# EAGLE design Schematic (EAGLE 7.7.0)
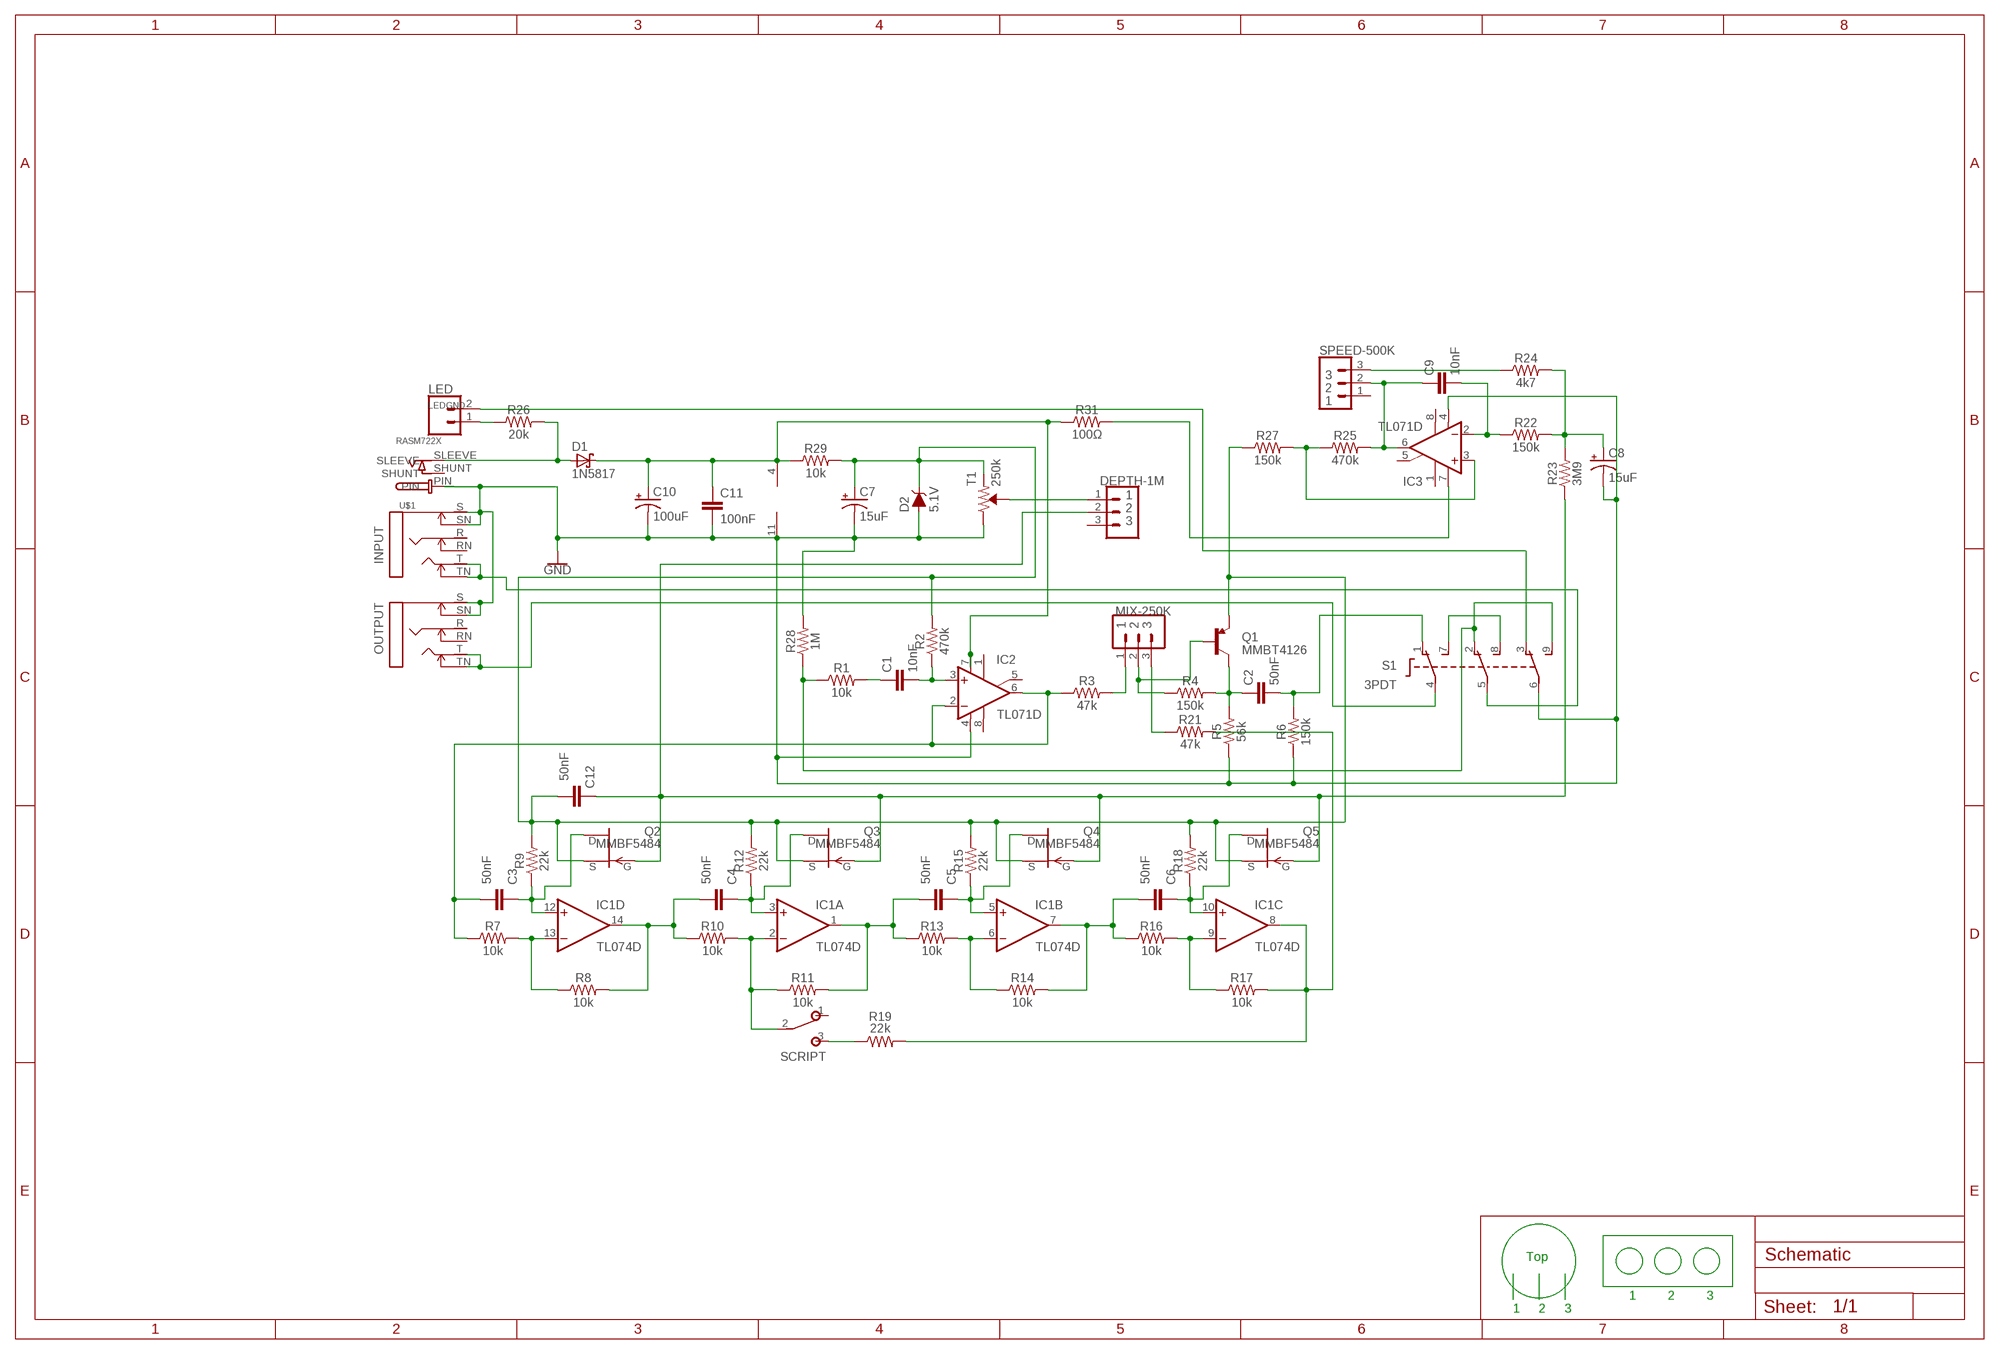
[diagram p0: schematic, sheet 1]

## Parts
C1  10nF  0.1UF-0603-25V-(+80/-20%)  [0603]
C2  50nF  0.1UF-0603-25V-(+80/-20%)  [0603]
C3  50nF  10NF-0603-50V-10%  [0603]
C4  50nF  10NF-0603-50V-10%  [0603]
C5  50nF  10NF-0603-50V-10%  [0603]
C6  50nF  10NF-0603-50V-10%  [0603]
C7  15uF  100UF-POLAR-EIA7343-10V-10%(TANT)  [EIA7343]
C8  15uF  100UF-POLAR-EIA7343-10V-10%(TANT)  [EIA7343]
C9  10nF  0.1UF-0603-25V-(+80/-20%)  [0603]
C10  100uF  100UF-POLAR-EIA7343-10V-10%(TANT)  [EIA7343]
C11  100nF  0.1UF-0603-25V-(+80/-20%)  [0603]
C12  50nF  10NF-0603-50V-10%  [0603]
D1  1N5817  1N5817-T  [DO41-7.6]
D2  5.1V  DIODE-ZENER-BZT52C3V6S  [SOD-323]
DEPTH-1M  CONN_03  [1X03]
IC1  TL074D  [SO14]
IC2  TL071D  [SO08]
IC3  TL071D  [SO08]
INPUT  STEREOSW  [NMJ6HCD2]
LED  CONN_02  [1X02]
MIX-250K  CONN_03  [1X03]
OUTPUT  STEREOSW  [NMJ6HCD2]
Q1  MMBT4126  TRANSISTOR_PNPMMBT4403  [SOT23-3]
Q2  MMBF5484  SST5484  [SOT23]
Q3  MMBF5484  SST5484  [SOT23]
Q4  MMBF5484  SST5484  [SOT23]
Q5  MMBF5484  SST5484  [SOT23]
R1  10k  10KOHM-0603-1/10W-1%  [0603]
R2  470k  22KOHM-0603-1/10W-1%  [0603]
R3  47k  10KOHM-0603-1/10W-1%  [0603]
R4  150k  10KOHM-0603-1/10W-1%  [0603]
R5  56k  22KOHM-0603-1/10W-1%  [0603]
R6  150k  22KOHM-0603-1/10W-1%  [0603]
R7  10k  10KOHM-0603-1/10W-1%  [0603]
R8  10k  10KOHM-0603-1/10W-1%  [0603]
R9  22k  22KOHM-0603-1/10W-1%  [0603]
R10  10k  10KOHM-0603-1/10W-1%  [0603]
R11  10k  10KOHM-0603-1/10W-1%  [0603]
R12  22k  22KOHM-0603-1/10W-1%  [0603]
R13  10k  10KOHM-0603-1/10W-1%  [0603]
R14  10k  10KOHM-0603-1/10W-1%  [0603]
R15  22k  22KOHM-0603-1/10W-1%  [0603]
R16  10k  10KOHM-0603-1/10W-1%  [0603]
R17  10k  10KOHM-0603-1/10W-1%  [0603]
R18  22k  22KOHM-0603-1/10W-1%  [0603]
R19  22k  10KOHM-0603-1/10W-1%  [0603]
R21  47k  10KOHM-0603-1/10W-1%  [0603]
R22  150k  10KOHM-0603-1/10W-1%  [0603]
R23  3M9  10KOHM-0603-1/10W-1%  [0603]
R24  4k7  10KOHM-0603-1/10W-1%  [0603]
R25  470k  10KOHM-0603-1/10W-1%  [0603]
R26  20k  10KOHM-0603-1/10W-1%  [0603]
R27  150k  10KOHM-0603-1/10W-1%  [0603]
R28  1M  10KOHM-0603-1/10W-1%  [0603]
R29  10k  10KOHM-0603-1/10W-1%  [0603]
R31  100Ω  10KOHM-0603-1/10W-1%  [0603]
S1  3PDT  [3PDT]
SCRIPT  SPDT  [M9040P]
SPEED-500K  CONN_03  [1X03]
T1  250k  TRIMPOT-SMD-3MM-CLOSED-1/8W-20%  [TRIMPOT-SMD-3MM-CLOSED]
U$1  RASM722X  [SWITCHCRAFT_RASM722X]

## Nets
1: MIX-250K.1 R3.2
2: C9.1 IC3.6(OUT) R25.2 SPEED-500K.2
3: R24.1 SPEED-500K.3
4: C10.A(+) C11.1 D1.C IC1.4(P:V+) IC2.7(V+) R29.1 R31.1
9V: D1.A R26.2 U$1.SLEEVE
ASD: DEPTH-1M.1 T1.2(WIPER)
GND: C7.C(-) C8.C(-) C10.C(-) C11.2 D2.A IC1.11(P:V-) IC2.4(V-) IC3.4(V-) INPUT.S INPUT.SN OUTPUT.S OUTPUT.SN R5.1 R6.1 R28.2 S1.6(P3) T1.3(CW) U$1.PIN
IN: INPUT.T INPUT.TN S1.5(P2)
INN: R1.1 R28.1 S1.2(O2) S1.9(S3)
LEDGND: LED.2 S1.3(O3)
N$1: C4.2 IC1.14(D:OUT) R8.2 R10.1
N$2: IC1.13(D:-IN) R7.2 R8.1
N$4: C1.2 IC2.3(+IN) R2.1
N$5: C3.1 IC1.12(D:+IN) Q2.1(D) R9.1
N$6: MIX-250K.3 R21.1
N$7: C6.2 IC1.7(B:OUT) R14.2 R16.1
N$8: C5.2 IC1.1(A:OUT) R11.2 R13.1
N$10: R19.1 SCRIPT.3(S)
N$11: C4.1 IC1.3(A:+IN) Q3.1(D) R12.1
N$12: LED.1 R26.1
N$13: IC1.6(B:-IN) R13.2 R14.1
N$14: IC1.8(C:OUT) R17.2 R19.2 R21.2
N$15: C5.1 IC1.5(B:+IN) Q4.1(D) R15.1
N$16: MIX-250K.2 Q1.1(B) R4.1
N$17: C1.1 R1.2
N$18: IC1.9(C:-IN) R16.2 R17.1
N$19: C3.2 IC2.2(-IN) IC2.6(OUT) R3.1 R7.1
N$20: C6.1 IC1.10(C:+IN) Q5.1(D) R18.1
N$21: C12.1 DEPTH-1M.2 Q2.3(G) Q3.3(G) Q4.3(G) Q5.3(G) R23.1
N$22: C2.1 Q1.3(C) R4.2 R5.2
N$23: IC3.7(V+) R31.2
N$24: C9.2 IC3.2(-IN) R22.1
N$25: C8.A(+) R22.2 R23.2 R24.2
N$26: C7.A(+) C12.2 D2.C Q1.2(E) Q2.2(S) Q3.2(S) Q4.2(S) Q5.2(S) R2.2 R9.2 R12.2 R15.2 R18.2 R27.1 R29.2 T1.1(CCW)
N$28: C2.2 R6.2 S1.1(O1)
N$29: IC3.3(+IN) R25.1 R27.2
N$30: IC1.2(A:-IN) R10.2 R11.1 SCRIPT.2(P)
N$31: S1.7(S1) S1.8(S2)
OUT: OUTPUT.T OUTPUT.TN S1.4(P1)
Unconnected: DEPTH-1M.3 IC2.1(ON1) IC2.5(ON2) IC2.8(OPT) IC3.1(ON1) IC3.5(ON2) IC3.8(OPT) INPUT.R INPUT.RN OUTPUT.R OUTPUT.RN SCRIPT.1(O) SPEED-500K.1

## Notes on the sheet
- Top
- 1 | 2 | 3
- 1 | 2 | 3

## Power pins joined to a net without a drawn wire
SHUNT: U$1.SHUNT

## Library data of the parts
C1 C2 C9 C11 = SparkFun-Capacitors:0.1UF: 0.1µF ceramic capacitors A capacitor is a passive two-terminal electrical component used to store electrical energy temporarily in an electric field.; PROD_ID: CAP-00810; VALUE: 0.1uF
C3-C6 C12 = SparkFun-Capacitors:10NF: 0.01uF/10nF/10,000pF ceramic capacitors A capacitor is a passive two-terminal electrical component used to store electrical energy temporarily in an electric field. CAP-09321; PROD_ID: CAP-00867; VALUE: 10nF
C7 C8 = SparkFun-Capacitors:100UF-POLAR: 100µF polarized capacitors A capacitor is a passive two-terminal electrical component used to store electrical energy temporarily in an electric field.; PROD_ID: CAP-07890; VALUE: 100uF
C10 = SparkFun-Capacitors:100UF-POLAR: 100µF polarized capacitors A capacitor is a passive two-terminal electrical component used to store electrical energy temporarily in an electric field.; PROD_ID: CAP-07890
D1 = diode:1N581*: 1.0A SCHOTTKY BARRIER RECTIFIER Source: http://www.diodes.com/datasheets/ds23001.pdf
D2 = SparkFun-DiscreteSemi:DIODE-ZENER: Zener Diode A Zener diode allows current to flow from its anode to its cathode like a normal semiconductor diode, but it also permits current to flow in the reverse direction when its "Zener voltage" is reached. - WIkipedia; PROD_ID: DIO-08199; VALUE: 3.6V
DEPTH-1M MIX-250K SPEED-500K = SparkFun-Connectors:CONN_03: Multi connection point. Often used as Generic Header-pin footprint for 0.1 inch spaced/style header connections On any of the 0.1 inch spaced packages, you can populate with these: Break Away Headers - Straight <https://www.sparkfun.com/products/116> (PRT-00116) Break Away Male Headers - Right Angle <https://www.sparkfun.com/products/553> (PRT-00553) Female Headers <https://www.sparkfun.com/products/115> (PRT-00115) Break Away Headers - Machine Pin <https://www.sparkfun.com/products/117> (PRT-00117) Break Away Female Headers - Swiss Machine Pin <https://www.sparkfun.com/products/743> (PRT-00743) Stackable Header - 3 Pin (Female, 0.1") <https://www.sparkfun.com/products/13875> (PRT-13875) For SCREWTERMINALS and SPRING TERMINALS visit here: Screw Terimnals on SparkFun.com <https://www.sparkfun.com/search/results?term=Screw+Terminals> (5mm/3.5mm/2.54mm spacing) This device is also useful as a general connection point to wire up your design to another part of your project. Our various solder wires solder well into these plated through hole pads. Hook-Up Wire - Assortment (Stranded, 22 AWG) <https://www.sparkfun.com/products/11375> (PRT-11375) Hook-Up Wire - Assortment (Solid Core, 22 AWG) <https://www.sparkfun.com/products/11367> (PRT-11367) View the entire wire category on our website here <https://www.sparkfun.com/categories/141> Special notes: Molex polarized connector foot print use with SKU : PRT-08232 with associated crimp pins and housings.
IC1 = linear:TL074: OP AMP
IC2 IC3 = linear:TL071: OP AMP
INPUT OUTPUT = gm-jacks:STEREOSW
LED = SparkFun-Connectors:CONN_02: Multi connection point. Often used as Generic Header-pin footprint for 0.1 inch spaced/style header connections On any of the 0.1 inch spaced packages, you can populate with these: Break Away Headers - Straight <https://www.sparkfun.com/products/116> (PRT-00116) Break Away Male Headers - Right Angle <https://www.sparkfun.com/products/553> (PRT-00553) Female Headers <https://www.sparkfun.com/products/115> (PRT-00115) Break Away Headers - Machine Pin <https://www.sparkfun.com/products/117> (PRT-00117) Break Away Female Headers - Swiss Machine Pin <https://www.sparkfun.com/products/743> (PRT-00743) For SCREWTERMINALS and SPRING TERMINALS visit here: Screw Terimnals on SparkFun.com <https://www.sparkfun.com/search/results?term=Screw+Terminals> (5mm/3.5mm/2.54mm spacing) This device is also useful as a general connection point to wire up your design to another part of your project. Our various solder wires solder well into these plated through hole pads. Hook-Up Wire - Assortment (Stranded, 22 AWG) <https://www.sparkfun.com/products/11375> (PRT-11375) Hook-Up Wire - Assortment (Solid Core, 22 AWG) <https://www.sparkfun.com/products/11367> (PRT-11367) View the entire wire category on our website here <https://www.sparkfun.com/categories/141> Special notes: Molex polarized connector foot print use with: PRT-08233 with associated crimp pins and housings. 2.54_SCREWTERM for use with PRT-10571. 3.5mm Screw Terminal footprints for PRT-08084 5mm Screw Terminal footprints for use with PRT-08432
Q1 = User-Submitted:TRANSISTOR_PNP: Generic PNP BJT Double check pinouts against datasheets- not all devices are the same! MMBT3906 - 40V 200mA SOT-23 (TRANS-08052) MMBT4403 - 40V 600mA SOT-23 (TRANS-09245); PROD_ID: TRANS-09245; VALUE: MMBT4403
Q2-Q5 = transistor-fet:?548*: N-Channel JFETs Source: VISHAY 2N5484.pdf Compatible: TO92 2N5245 J304 J305 U310 J308 J309 J310 TO72 2N4416 2N4416A 2N3823 2N4351 3N169 3N170 3N171 MFE3002 TO18 2N3796 2N3797 MFE825 Source: Motorola European Master Guide Pacge 3-59
R1 R7 R8 R10 R11 R13 R14 R16 R17 R29 = SparkFun-Resistors:10KOHM: 10kΩ resistor A resistor is a passive two-terminal electrical component that implements electrical resistance as a circuit element. Resistors act to reduce current flow, and, at the same time, act to lower voltage levels within circuits. - Wikipedia; PROD_ID: RES-00824
R2 R5 R6 = SparkFun-Resistors:22KOHM: 22kΩ resistor A resistor is a passive two-terminal electrical component that implements electrical resistance as a circuit element. Resistors act to reduce current flow, and, at the same time, act to lower voltage levels within circuits. - Wikipedia; PROD_ID: RES-07853; VALUE: 22k
R3 R4 R19 R21-R28 R31 = SparkFun-Resistors:10KOHM: 10kΩ resistor A resistor is a passive two-terminal electrical component that implements electrical resistance as a circuit element. Resistors act to reduce current flow, and, at the same time, act to lower voltage levels within circuits. - Wikipedia; PROD_ID: RES-00824; VALUE: 10k
R9 R12 R15 R18 = SparkFun-Resistors:22KOHM: 22kΩ resistor A resistor is a passive two-terminal electrical component that implements electrical resistance as a circuit element. Resistors act to reduce current flow, and, at the same time, act to lower voltage levels within circuits. - Wikipedia; PROD_ID: RES-07853
S1 = switch:3PDT: 3PDT 9 pin footswitch SF17020F-0302-21R-L Source: 3PDT.jpg
SCRIPT = gm-switches:SPDT: TOGGLE SWITCH Marquardt
T1 = SparkFun-Resistors:TRIMPOT: Trimming Potentiometer (Trimpot) Three-terminal potentiometers, with an adjustable wiper and two adjustable resistors. A pot can be used to create a configurable voltage divider, or as a variable resistor. "Trimpots" are a subset of potentiometers, usually intended for "set-and-forget" applications. They're often more delicate than standard potentiometers - rated for fewer turns. Variants PTH-KNOB - PTH Trimpot w/ finger-adjustable knob Trimpot 10K with Knob <https://www.sparkfun.com/products/9806> (COM-09806) Datasheet <http://www.sparkfun.com/datasheets/Components/General/TSR-3386.pdf> SMD-3MM-CLOSED-FRAME - SMD 3mm Square Closed-Frame Trimpot Used on e.g. EasyDriver - Stepper Motor Driver <https://www.sparkfun.com/products/12779> Datasheet <http://www.bitechnologies.com/pdfs/22.pdf> (22AR10KTR) SMD-5MM - SMD 5mm Square Closed-Frame Trimpot Used on e.g. IOIO-OTG - V2.2 <https://www.sparkfun.com/products/13613> Datasheet <http://www.vishay.com/docs/51008/ts53.pdf> (TS53YL502MR10) SMD-3MM-1/10W-25% - 3mm Square Open-Frame Trimpot Used on e.g. SparkFun Shapeoko <https://www.sparkfun.com/products/13899> Datasheet <http://www.bourns.com/docs/Product-Datasheets/TC33.pdf> (TC33X-2-103E); PROD_ID: RES-09285; VALUE: 10k
U$1 = RASM722X:RASM722X: Connector; Miniature Power Jack; 0.57 in.; 0.08; Surface Mount; AVAILABILITY: Good; DESCRIPTION: Connector; Miniature Power Jack; 0.57 in.; 0.08; Surface Mount; MF: Switchcraft; MP: RASM722X; PACKAGE: None; PRICE: 0.97 USD

## Net classes
0 default: width 0.152 mm, drill 0.33 mm, clearance 0.152 mm

## Board
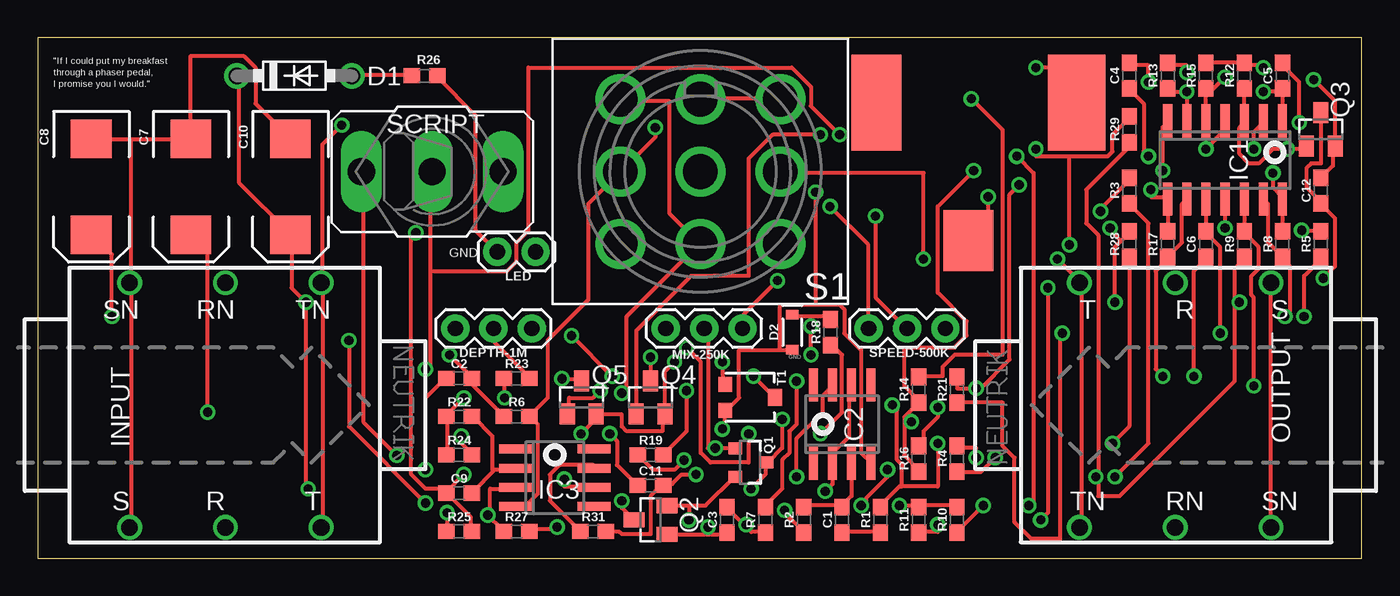
[diagram p1: board, top side]
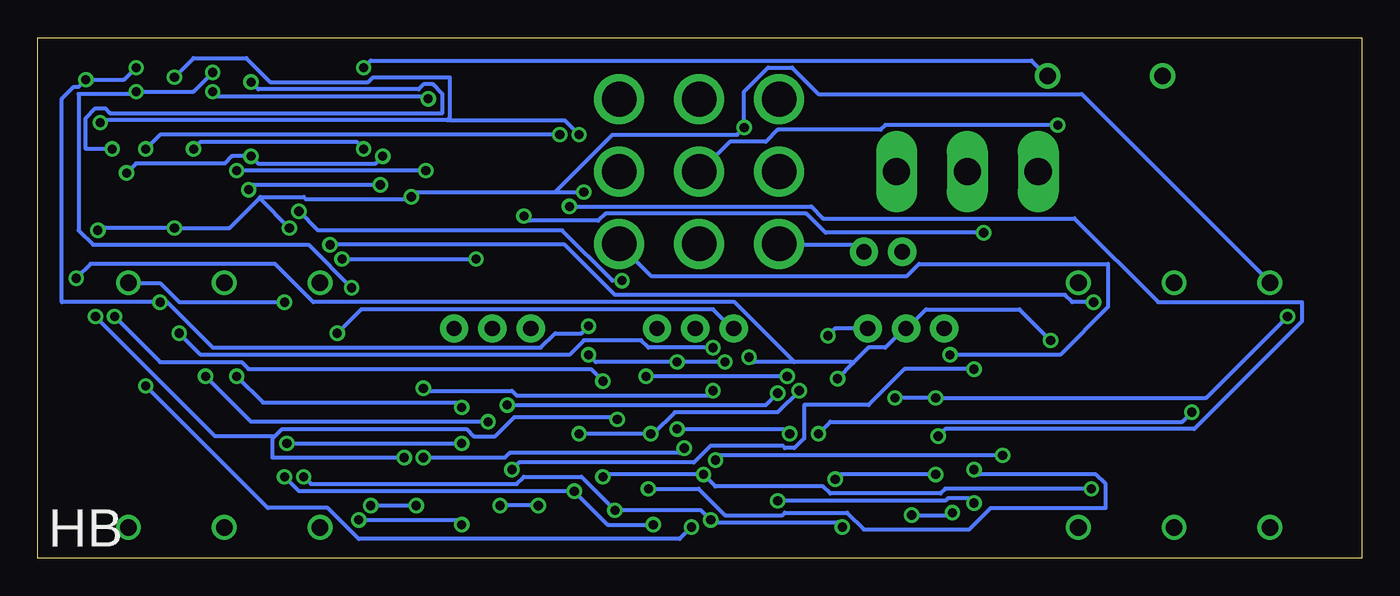
[diagram p2: board, bottom side, seen from below]

Size 87.81 x 34.53 mm. Coordinates in mm from the lower left corner, seen from the top.
Outline: 0,0 87.81,0 87.81,34.53 0,34.53 0,0
Copper layers (1*16): Top 0.035mm / dielectric 1.5mm / Bottom 0.035mm
Design rules "default": minimum track width 10mil, minimum drill 24mil, track to track 8mil, track to pad 8mil, pad to pad 8mil, via to via 8mil, smd to smd 8mil, copper to edge 40mil, drill to drill 8mil, minimum pad ring 10mil, minimum via ring 8mil, stop-mask expansion 4mil, vias tented up to drill 0mil, thermal gap 10mil

### Footprints (pad centres in the part's own frame; a part is rotated, then mirrored left to right if it is on the bottom)
0603 = smd 1.1 x 1: 1 -0.85,0; 2 0.85,0
EIA7343 = smd 2.55 x 2.7: A 3.17,0; C -3.17,0
DO41-7.6 = drill 1.1 pad 1.7: A 3.81,0; C -3.81,0
SOD-323 = smd 0.63 x 0.83: A 1.15,0; C -1.15,0
1X03 = drill 1.016 pad 1.88: 1 0,0; 2 2.54,0; 3 5.08,0
SO14 = smd 0.6 x 2.2: 1 -3.81,-2.6; 2 -2.54,-2.6; 3 -1.27,-2.6; 4 0,-2.6; 5 1.27,-2.6; 6 2.54,-2.6; 7 3.81,-2.6; 8 3.81,2.6; 9 2.54,2.6; 10 1.27,2.6; 11 0,2.6; 12 -1.27,2.6; 13 -2.54,2.6; 14 -3.81,2.6
SO08 = smd 0.6 x 2.2: 1 -1.905,-2.6; 2 -0.635,-2.6; 3 0.635,-2.6; 4 1.905,-2.6; 5 1.905,2.6; 6 0.635,2.6; 7 -0.635,2.6; 8 -1.905,2.6
NMJ6HCD2 = drill 1.1: R 0,8.115; RN 0,-8.115; S 6.35,8.115; SN 6.35,-8.115; T -6.35,8.115; TN -6.35,-8.115
1X02 = drill 1.016 pad 1.88: 1 0,0; 2 2.54,0
SOT23-3 = smd 0.8 x 0.9: 1 -0.95,-1; 2 0.95,-1; 3 0,1.1
SOT23 = smd 1 x 1.4: 1 -0.95,-1.1; 2 0.95,-1.1; 3 0,1.1
3PDT = drill 2.3 pad 3.1: 1 -5.3,4.8; 2 0,4.8; 3 5.3,4.8; 4 -5.3,0; 5 0,0; 6 5.3,0; 7 -5.3,-4.8; 8 0,-4.8; 9 5.3,-4.8
M9040P = drill 1.803 long: 1 0,4.699; 2 0,0; 3 0,-4.699
TRIMPOT-SMD-3MM-CLOSED = smd 1 x 0.9: 1 -0.85,-1.65; 3 0.85,-1.65 | smd 1.1 x 0.9: 2 0,1.65
SWITCHCRAFT_RASM722X = smd 3.3 x 4.06: PIN 0,0 | smd 3.3 x 6.35: SHUNT 6.099,-9.14 | smd 3.81 x 6.35: SLEEVE -7.189,-9.14

### Placement (x,y rotation side)
C1  53.34,2.54 90 top
C2  27.94,11.94 0 top
C3  45.72,2.54 90 top
C4  72.39,32 270 top
C5  82.55,32 270 top
C6  77.47,20.83 270 top
C7  10.16,24.64 270 top
C8  3.56,24.64 270 top
C9  27.94,4.32 0 top
C10  16.76,24.64 270 top
C11  40.64,4.83 180 top
C12  85.09,24.38 90 top
D1  17.02,32 0 top
D2  50.04,14.99 270 top
DEPTH-1M  32.77,15.24 180 top
IC1  78.74,26.42 180 top
IC2  53.34,8.89 0 top
IC3  34.29,5.33 270 top
INPUT  12.45,10.16 180 top
LED  30.48,20.32 0 top
MIX-250K  46.74,15.24 180 top
OUTPUT  75.44,10.16 0 top
Q1  47.24,6.35 270 top
Q2  40.64,2.54 90 top
Q3  85.09,28.45 0 top
Q4  40.64,10.67 0 top
Q5  36.07,10.67 0 top
R1  55.88,2.54 270 top
R2  50.8,2.54 270 top
R3  72.39,24.38 90 top
R4  60.96,6.6 270 top
R5  85.09,20.83 270 top
R6  31.75,9.4 180 top
R7  48.26,2.54 90 top
R8  82.55,20.83 90 top
R9  80.01,20.83 270 top
R10  60.96,2.54 90 top
R11  58.42,2.54 270 top
R12  80.01,32 90 top
R13  74.93,32 270 top
R14  58.42,11.18 270 top
R15  77.47,32 90 top
R16  58.42,6.6 90 top
R17  74.93,20.83 90 top
R18  52.58,14.99 90 top
R19  40.64,6.86 0 top
R21  60.96,11.18 90 top
R22  27.94,9.4 180 top
R23  31.75,11.94 180 top
R24  27.94,6.86 180 top
R25  27.94,1.78 0 top
R26  25.65,32 180 top
R27  31.75,1.78 180 top
R28  72.39,20.83 90 top
R29  72.39,28.45 270 top
R31  36.83,1.78 180 top
S1  43.94,25.65 180 top
SCRIPT  26.16,25.65 270 top
SPEED-500K  60.2,15.24 180 top
T1  47.24,10.67 270 top
U$1  61.72,21.08 180 top

### Tracks (layer width: path | path; a pad name or v marks a point on that pad's centre or on a via)
1  (via drill 0.61)
  Top 0.254: v70.48,23.02 70.48,23.18 72.39,25.08 R3.2 | v49.05,18.41 46.83,16.19 46.83,15.24 MIX-250K.1
  Bottom 0.254: v70.48,23.02 69.22,21.75 53.02,21.75 49.69,18.41 v49.05,18.41
2  (via drill 0.61)
  Top 0.254: C9.1 27.15,4.29 28.73,2.7 28.73,1.91 R25.2 | v34.92,5.24 34.92,4.76 36.83,4.76 IC3.6 | v28.26,5.56 27.15,4.45 C9.1 | v55.56,22.7 55.56,17.3 57.63,15.24 SPEED-500K.2 | v25.08,21.59 24.77,21.27 24.77,5.56 25.72,4.6 27.15,4.6 C9.1
  Bottom 0.254: v34.92,5.24 34.61,5.56 v28.26,5.56 | v55.56,22.7 55.24,22.38 50.64,22.38 50.16,22.86 36.83,22.86 35.56,21.59 v25.08,21.59
3  (via drill 0.61)
  Top 0.254: v28.1,8.1 28.1,7.62 28.73,6.99 R24.1 | v52.55,23.34 55.09,20.8 55.09,15.24 SPEED-500K.3
  Bottom 0.254: v28.1,8.1 27.62,8.57 11.11,8.57 3.97,15.72 3.97,16.99 13.49,16.99 19.05,22.54 35.72,22.54 36.51,23.34 v52.55,23.34
4  (via drill 0.61)
  Top 0.254: R31.1 37.78,1.75 38.58,1.75 38.73,1.59 40.64,1.59 40.64,4.13 41.43,4.92 C11.1 41.59,4.92 42.07,4.92 42.7,5.56 v43.66,5.56 | v50.32,5.4 50.32,7.94 52.07,9.68 52.07,10.79 52.7,11.43 IC2.7 | 68.42,26.67 66.2,26.67 v66.2,27.15 | 68.42,26.67 70.96,26.67 71.28,26.99 71.28,28.1 72.39,29.21 R29.1 | v77.47,27.15 78.74,28.42 IC1.4 | D1.C 13.34,31.91 13.34,24.92 16.67,21.59 C10.A 16.83,21.43 16.83,17.94 v17.78,16.99 17.78,4.76 v17.94,4.6 | v68.42,20.8 68.42,26.67
  Bottom 0.254: v50.32,5.4 50.16,5.56 v43.66,5.56 42.86,4.76 35.72,4.76 35.24,4.29 27.94,4.29 27.62,4.6 v17.94,4.6 | v66.2,27.15 66.67,27.62 76.99,27.62 v77.47,27.15 | v68.42,20.8 52.86,20.8 49.53,17.46 19.68,17.46 19.21,16.99 v17.78,16.99
9V  (via drill 0.61)
  Top 0.254: R26.2 24.77,32.07 20.95,32.07 D1.A | v66.2,32.54 68.9,32.54 68.9,30.32 U$1.SLEEVE
  Bottom 0.254: v66.2,32.54 65.72,33.02 21.91,33.02 20.95,32.07 D1.A
ASD  (via drill 0.61)
  Top 0.254: v47.47,12.06 48.74,10.79 T1.2 | v35.4,14.76 v38.1,12.06
  Bottom 0.254: v38.1,12.06 v47.47,12.06 | v35.4,14.76 34.92,15.24 DEPTH-1M.1
GND  (via drill 0.61)
  Top 0.254: 6.19,27.78 10.16,27.78 C7.C 10.16,33.34 13.65,33.34 14.45,32.54 14.45,30.16 16.67,27.94 C10.C | 6.19,27.78 3.65,27.78 C8.C | INPUT.S 6.19,2.06 6.19,18.26 INPUT.SN 6.19,18.41 6.19,27.78 | IC3.4 31.75,3.49 32.38,3.49 33.18,4.29 33.18,8.89 32.7,9.37 R6.1 32.7,9.53 33.81,10.64 33.81,14.45 36.51,17.14 36.51,23.5 38.58,25.56 S1.6 38.73,25.72 40.96,27.94 v40.96,28.57 | 71.83,21.03 71.44,20.64 v71.44,16.99 | 71.83,21.03 72.39,21.59 R28.2 | OUTPUT.SN 81.76,2.06 81.76,18.26 OUTPUT.S | 49.21,13.81 46.51,13.81 46.51,10.64 45.72,9.84 T1.3 45.56,9.68 45.56,8.73 v45.4,8.57 | 49.21,13.81 50.01,13.81 D2.A | v37.94,8.26 38.42,7.78 38.42,6.19 39.69,4.92 C11.2 | 51.59,16.83 49.21,16.83 49.21,13.81 | 51.59,16.83 53.18,16.83 53.5,16.51 53.5,14.92 54.61,13.81 54.61,6.99 55.24,6.35 IC2.4 | v83.82,21.75 85.09,21.75 R5.1 | IC1.11 v78.74,21.91 | U$1.PIN 63.02,22.38 v63.02,23.97 | v51.59,24.29 51.59,16.83 | 71.83,21.03 71.12,21.75 v71.12,21.91
  Bottom 0.254: v71.44,16.99 78.42,16.99 79.69,18.26 81.76,18.26 OUTPUT.S | v37.94,8.26 38.26,8.57 v45.4,8.57 | v83.82,21.75 83.66,21.91 v78.74,21.91 75.09,21.91 73.1,23.89 | 73.1,23.89 73.03,23.97 70.17,23.97 70.01,23.81 63.18,23.81 v63.02,23.97 62.71,24.29 53.5,24.29 | 53.5,24.29 v51.59,24.29 | 73.1,23.89 v71.12,21.91 | 53.5,24.29 49.69,28.1 41.43,28.1 v40.96,28.57 40.96,30.96 39.37,32.54 37.78,32.54 36.04,30.8 18.57,30.8 6.19,18.41 INPUT.SN
IN  (via drill 0.61)
  Top 0.254: INPUT.T 18.89,2.06 18.89,18.26 INPUT.TN 18.89,18.41 18.89,27.46 v20.16,28.73
  Bottom 0.254: v20.16,28.73 31.59,28.73 31.91,28.42 38.73,28.42 39.53,27.62 41.91,27.62 43.81,25.72 S1.5
INN  (via drill 0.61)
  Top 0.254: S1.9 38.73,30.32 41.91,30.32 41.91,22.86 43.81,20.95 S1.2 43.81,20.8 39.05,16.03 39.05,11.27 v38.73,10.95 | 57.31,4.76 59.69,4.76 v59.69,7.62 | 57.31,4.76 57.15,4.76 55.88,3.49 R1.1 | v71.28,7.62 72.39,8.73 R28.1 | v56.67,10.16 56.99,9.84 56.99,6.51 57.31,6.19 57.31,4.76
  Bottom 0.254: v71.28,7.62 v59.69,7.62 | v38.73,10.95 39.53,10.16 v56.67,10.16
LEDGND
  Bottom 0.254: LED.2 33.5,20.8 38.58,20.8 S1.3
N$1  (via drill 0.61)
  Top 0.254: R8.2 IC1.14 82.55,23.97 81.92,24.61 v81.92,25.56 | v62.71,3.49 60.96,1.75 R10.1 | v65.72,3.49 66.04,3.81 66.04,25.56 v64.93,26.67 | v73.66,26.67 73.34,26.99 73.34,30.16 72.39,31.11 C4.2
  Bottom 0.254: v65.72,3.49 v62.71,3.49 | v64.93,26.67 65.41,26.19 73.18,26.19 v73.66,26.67 74.93,26.67 75.41,26.19 81.28,26.19 v81.92,25.56
N$2  (via drill 0.61)
  Top 0.254: v50.32,11.75 50.32,8.89 49.85,8.41 49.85,6.99 49.37,6.51 49.37,4.6 48.26,3.49 R7.2 | v82.71,16.03 83.03,16.35 83.03,19.37 82.55,19.84 R8.1 82.55,20 81.6,20.95 81.6,23.5 IC1.13
  Bottom 0.254: v50.32,11.75 51.12,12.54 73.82,12.54 74.3,13.02 79.69,13.02 v82.71,16.03
N$4
  Top 0.254: 53.34,3.49 50.8,3.49 R2.1 | 53.34,3.49 53.98,4.13 IC2.3 | 53.34,3.49 C1.2
N$5  (via drill 0.61)
  Top 0.254: IC1.12 R9.1 80.01,21.59 80.96,20.64 80.96,19.21 80.49,18.73 80.49,17.46 80.64,17.3 v80.64,11.43 | 44.45,1.59 Q2.1 | 44.45,1.59 45.72,1.59 C3.1 | 44.45,1.59 v44.45,2.06
  Bottom 0.254: v80.64,11.43 72.55,3.33 68.58,3.33 66.52,1.27 45.24,1.27 v44.45,2.06
N$6  (via drill 0.61)
  Top 0.254: v67.94,14.92 67.79,14.76 67.79,1.27 65.88,1.27 64.77,2.38 64.77,6.67 63.98,7.46 63.98,10.32 R21.1
  Bottom 0.254: v67.94,14.92 66.36,16.51 43.02,16.51 41.75,15.24 MIX-250K.3
N$7  (via drill 0.61)
  Top 0.254: 57.55,9.45 R14.2 58.42,10.48 57.47,11.43 57.47,13.97 60.8,13.97 61.59,14.76 61.59,15.72 59.69,17.62 59.69,23.34 v62.07,25.72 | 57.55,9.45 57.47,9.37 57.47,6.83 58.42,5.87 R16.1 | v76.68,12.06 76.68,19.05 77.47,19.84 C6.2 | 57.55,9.45 v57.94,9.05 | v74.61,25.72 74.61,28.57 74.93,28.89 IC1.7
  Bottom 0.254: v76.68,12.06 73.66,9.05 v57.94,9.05 | v62.07,25.72 v74.61,25.72
N$8  (via drill 0.61)
  Top 0.254: v59.69,2.22 59.69,1.75 58.42,1.75 R11.2 | v66.52,2.54 66.99,3.02 v66.99,17.94 | 82.55,30.96 v81.28,30.96 | 82.55,30.96 C5.2 82.55,31.11 | v76.2,32.23 76.2,32.7 74.93,32.7 R13.1 | 82.55,30.96 IC1.1
  Bottom 0.254: v59.69,2.22 60.01,2.54 v66.52,2.54 | v66.99,17.94 69.85,20.8 84.14,20.8 85.09,21.75 85.09,30.8 81.44,30.8 v81.28,30.96 77.47,30.96 v76.2,32.23
N$10  (via drill 0.61)
  Top 0.254: v42.86,6.51 42.23,5.87 40.8,5.87 39.85,6.83 R19.1 | v23.81,6.83 21.59,9.05 21.59,25.56 SCRIPT.3
  Bottom 0.254: v42.86,6.51 42.55,6.83 v23.81,6.83
N$11  (via drill 0.61)
  Top 0.254: R12.1 IC1.3 80.01,28.89 79.69,28.57 79.69,26.83 80.33,26.19 80.96,26.19 81.92,27.15 v82.87,27.15 84.14,27.15 84.14,27.3 Q3.1 | v73.66,31.59 73.66,32.7 72.39,32.7 C4.1
  Bottom 0.254: v73.66,31.59 73.18,31.11 62.55,31.11 62.23,31.43 61.59,31.43 60.96,30.8 60.96,29.53 83.03,29.53 83.34,29.84 83.98,29.84 84.61,29.21 84.61,27.15 v82.87,27.15
N$12
  Top 0.254: LED.1 29.05,21.75 29.05,29.37 26.51,31.91 R26.1
N$13  (via drill 0.61)
  Top 0.254: v61.91,30.48 63.98,28.42 63.98,13.49 60.8,13.49 60.01,12.7 60.01,12.06 58.42,12.06 R14.1 | R13.2 74.93,30.96 v76.2,30.96 IC1.6
  Bottom 0.254: v61.91,30.48 62.07,30.64 75.88,30.64 v76.2,30.96
N$14  (via drill 0.61)
  Top 0.254: R17.2 IC1.8 74.93,23.97 73.82,23.97 v73.82,24.45 | v43.02,11.11 43.02,8.41 41.59,6.99 R19.2 | R21.2 60.96,11.27 v62.23,11.27 62.55,11.27 64.45,13.18 64.45,24.13 v65.09,24.77
  Bottom 0.254: v43.02,11.11 43.34,10.79 56.04,10.79 56.36,11.11 62.07,11.11 v62.23,11.27 | v73.82,24.45 73.5,24.77 v65.09,24.77
N$15  (via drill 0.61)
  Top 0.254: IC1.5 77.47,30.64 | 77.47,30.64 R15.1 77.47,31.11 | v83.66,28.89 83.66,31.59 82.55,32.7 C5.1 | 77.47,30.64 v78.74,31.91 | v51.91,28.1 48.74,28.1 47.15,26.51 47.15,18.73 43.34,18.73 39.69,15.08 39.69,9.68 Q4.1
  Bottom 0.254: v83.66,28.89 83.5,29.05 60.64,29.05 60.56,29.13 | 60.56,29.13 60.48,29.21 60.48,31.91 65.56,31.91 65.88,31.59 72.39,31.59 73.98,33.18 77.47,33.18 v78.74,31.91 | v51.91,28.1 52.86,29.05 60.48,29.05 60.56,29.13
N$16  (via drill 0.61)
  Top 0.254: Q1.1 46.2,7.3 v44.93,7.3 44.45,7.3 44.45,15.08 44.29,15.24 MIX-250K.2 | v62.23,6.67 62.23,7.3 60.96,7.3 R4.1
  Bottom 0.254: v62.23,6.67 56.83,6.67 56.52,6.99 45.24,6.99 v44.93,7.3
N$17
  Top 0.254: C1.1 53.34,1.75 55.88,1.75 R1.2
N$18  (via drill 0.61)
  Top 0.254: v59.69,10 59.69,9.37 58.74,8.41 58.74,7.78 58.42,7.46 R16.2 | v74.61,12.06 74.14,12.54 74.14,19.05 74.93,19.84 R17.1 74.93,20 75.88,20.95 75.88,23.5 IC1.9
  Bottom 0.254: v59.69,10 60.01,10.32 72.87,10.32 v74.61,12.06
N$19  (via drill 0.61)
  Top 0.254: 46.91,2.14 47.31,1.75 48.26,1.75 R7.1 | 46.91,2.14 45.72,3.33 C3.2 | v71.44,5.4 73.66,7.62 73.66,22.23 72.39,23.5 R3.1 | v52.23,4.45 52.7,4.92 IC2.2 52.7,6.99 53.82,8.1 53.82,11.27 53.98,11.43 IC2.6 | v46.99,2.22 46.91,2.14
  Bottom 0.254: v71.44,5.4 70.48,4.45 v52.23,4.45 50.01,2.22 v46.99,2.22
N$20  (via drill 0.61)
  Top 0.254: IC1.10 C6.1 77.47,21.59 78.42,20.64 v78.42,14.92 | v51.91,8.26 53.34,9.68 53.34,13.49 52.7,14.13 R18.1 | v37.31,11.11 36.83,10.64 35.24,10.64 35.24,9.68 Q5.1 | v43.02,13.97 43.97,13.02 43.97,6.99 44.61,6.35 47.15,6.35 v47.15,8.26
  Bottom 0.254: v51.91,8.26 v47.15,8.26 46.99,8.26 45.56,9.68 38.73,9.68 v37.31,11.11 | v78.42,14.92 76.99,13.49 52.55,13.49 51.59,14.45 47.78,14.45 47.31,13.97 v43.02,13.97
N$21  (via drill 0.61)
  Top 0.254: Q3.3 85.09,26.19 84.45,26.19 84.14,25.88 84.14,24.61 85.09,23.65 C12.1 85.09,23.5 86.04,22.54 86.04,19.37 v85.25,18.57 | R23.1 32.54,12.06 30.32,14.29 30.32,15.24 DEPTH-1M.2 | v38.73,3.81 38.73,3.33 Q2.3 | v25.72,3.65 20.64,8.73 v20.64,14.45 | v34.77,11.91 36.04,11.91 Q5.3 | v40.64,13.34 Q4.3
  Bottom 0.254: v38.73,3.81 27.62,3.81 27.46,3.97 26.04,3.97 v25.72,3.65 | v20.64,14.45 22.7,16.51 28.89,16.51 30.16,15.24 DEPTH-1M.2 30.32,15.24 31.59,13.97 32.7,13.97 33.73,12.94 | 33.73,12.94 v34.77,11.91 | v40.64,13.34 40.32,13.02 37.62,13.02 | 37.62,13.02 33.81,13.02 33.73,12.94 | v85.25,18.57 84.3,19.53 72.07,19.53 69.53,16.99 41.59,16.99 37.62,13.02
N$22  (via drill 0.61)
  Top 0.254: v49.37,9.21 49.37,7.3 48.42,6.35 Q1.3 48.26,6.35 48.26,5.56 v47.31,4.6 | v63.5,6.67 62.55,5.71 60.96,5.71 R4.2 | v25.72,5.87 25.72,10.64 26.99,11.91 C2.1 | v83.98,16.03 83.98,18.73 85.09,19.84 R5.2
  Bottom 0.254: v49.37,9.21 49.53,9.37 56.2,9.37 57.47,8.1 58.9,8.1 59.37,8.57 71.6,8.57 72.15,8.02 | 72.15,8.02 72.23,7.94 72.23,6.67 v63.5,6.67 | v25.72,5.87 25.4,5.56 17.62,5.56 16.99,4.92 16.99,3.33 24.61,3.33 26.04,1.91 33.02,1.91 34.13,3.02 38.26,3.02 38.42,2.86 42.23,2.86 43.97,4.6 v47.31,4.6 | v83.98,16.03 76.04,8.1 72.23,8.1 72.15,8.02
N$23
  Top 0.254: R31.2 35.88,1.91 33.97,3.81 33.97,5.56 34.61,6.19 36.83,6.19 36.83,6.03 IC3.7
N$24
  Top 0.254: 30.24,5.79 30.32,5.87 31.59,5.87 IC3.2 | 30.24,5.79 28.89,4.45 C9.2 | R22.1 28.89,9.37 30.16,8.1 30.16,5.87 30.24,5.79
N$25  (via drill 0.61)
  Top 0.254: R24.2 27.15,6.99 27.15,9.37 R22.2 27.15,9.53 v28.26,10.64 | v30.96,10.64 30.96,11.91 R23.2 | v4.92,16.03 4.92,20.16 3.65,21.43 C8.A
  Bottom 0.254: v30.96,10.64 v28.26,10.64 10.32,10.64 v4.92,16.03
N$26  (via drill 0.61)
  Top 0.254: 51.28,16.03 52.55,16.03 52.55,15.88 R18.2 | 51.28,16.03 50.16,16.03 D2.C | v45.4,13.02 45.4,11.75 45.56,11.59 T1.1 | v42.23,13.02 41.59,12.38 41.59,9.68 Q4.2 41.43,9.53 41.43,8.41 39.05,8.41 38.73,8.73 38.73,9.53 37.15,9.53 Q5.2 36.99,9.53 36.99,9.21 v36.04,8.26 | v51.28,13.49 v51.28,15.4 51.28,16.03 | v11.27,9.68 11.27,20.32 10.16,21.43 C7.A | 43.18,3.49 Q2.2 | 43.18,3.49 44.29,3.49 46.2,5.4 Q1.2 | v34.45,2.06 34.45,1.91 32.7,1.91 R27.1 | 43.18,3.49 v43.18,2.54 | v49.53,3.17 49.53,3.02 50.8,1.75 R2.2 | R15.2 R12.2 80.01,32.7 81.28,32.7 v81.28,32.54 | C12.2 85.88,26.04 85.88,27.3 Q3.2 86.04,27.46 86.04,30.32 v84.61,31.75 | 79.38,16.99 79.38,11.75 71.75,4.13 70.33,4.13 70.33,5.4 | 79.38,16.99 79.38,19.21 80.01,19.84 R9.2 | 70.33,5.4 70.33,21.43 69.53,22.23 69.53,24.45 72.39,27.3 R29.2 | 79.38,16.99 v79.69,16.99 | 70.33,5.4 v70.17,5.4
  Bottom 0.254: v42.23,13.02 v45.4,13.02 50.8,13.02 v51.28,13.49 | v11.27,9.68 11.91,9.05 35.24,9.05 v36.04,8.26 | v34.45,2.06 34.77,2.38 43.02,2.38 v43.18,2.54 43.81,3.17 v49.53,3.17 51.75,5.4 55.56,5.4 56.04,4.92 69.69,4.92 v70.17,5.4 | v81.28,32.54 82.07,31.75 v84.61,31.75 85.09,31.27 85.41,31.27 86.2,30.48 86.2,16.99 v79.69,16.99 79.22,16.99 76.2,13.97 54.45,13.97 53.5,14.92 51.75,14.92 v51.28,15.4
N$28  (via drill 0.61)
  Top 0.254: R6.2 30.8,9.53 28.89,11.43 28.89,11.91 C2.2 28.73,12.06 v27.3,13.49
  Bottom 0.254: v27.3,13.49 20,13.49 16.83,16.67 16.83,19.53 29.37,19.53 30.16,18.73 47.15,18.73 49.21,20.8 S1.1
N$29  (via drill 0.61)
  Top 0.254: v27.15,3.02 27.15,1.91 R25.1 | R27.2 30.8,1.91 v29.84,2.86 30,2.86 30,4.6 31.59,4.6 IC3.3
  Bottom 0.254: v27.15,3.02 27.3,2.86 v29.84,2.86
N$30  (via drill 0.61)
  Top 0.254: 58.42,3.49 60.96,3.49 R10.2 | v57.15,3.49 58.42,3.49 | v54.61,3.49 54.93,3.81 54.93,3.97 56.36,5.4 v56.36,5.87 | v25.72,12.54 26.04,12.86 26.04,19.05 | 26.04,19.05 26.04,25.56 SCRIPT.2 | 58.42,3.49 R11.1 | v80.64,27.15 80.64,28.26 81.28,28.89 IC1.2 | v53.18,28.1 51.28,30 51.28,31.27 50.01,32.54 32.54,32.54 32.54,21.75 31.75,20.95 31.75,19.68 31.11,19.05 26.04,19.05
  Bottom 0.254: v54.61,3.49 v57.15,3.49 | v56.36,5.87 55.88,6.35 44.29,6.35 43.18,7.46 38.42,7.46 38.26,7.3 37.62,7.3 36.99,7.94 36.99,10.16 32.7,10.16 30.32,12.54 v25.72,12.54 | v80.64,27.15 79.69,28.1 v53.18,28.1
N$31
  Top 0.254: S1.8 43.97,30.48 49.21,30.48 S1.7
OUT  (via drill 0.61)
  Top 0.254: OUTPUT.TN 69.22,2.06 69.22,18.26 OUTPUT.T 69.06,18.41 v67.63,19.84 | v58.74,19.84 58.74,25.56 49.37,25.56 S1.4
  Bottom 0.254: v67.63,19.84 v58.74,19.84

### Text on the board
tPlace: "If I could put my breakfast | through a phaser pedal, | I promise you I would." | GND | GND
bPlace: HB